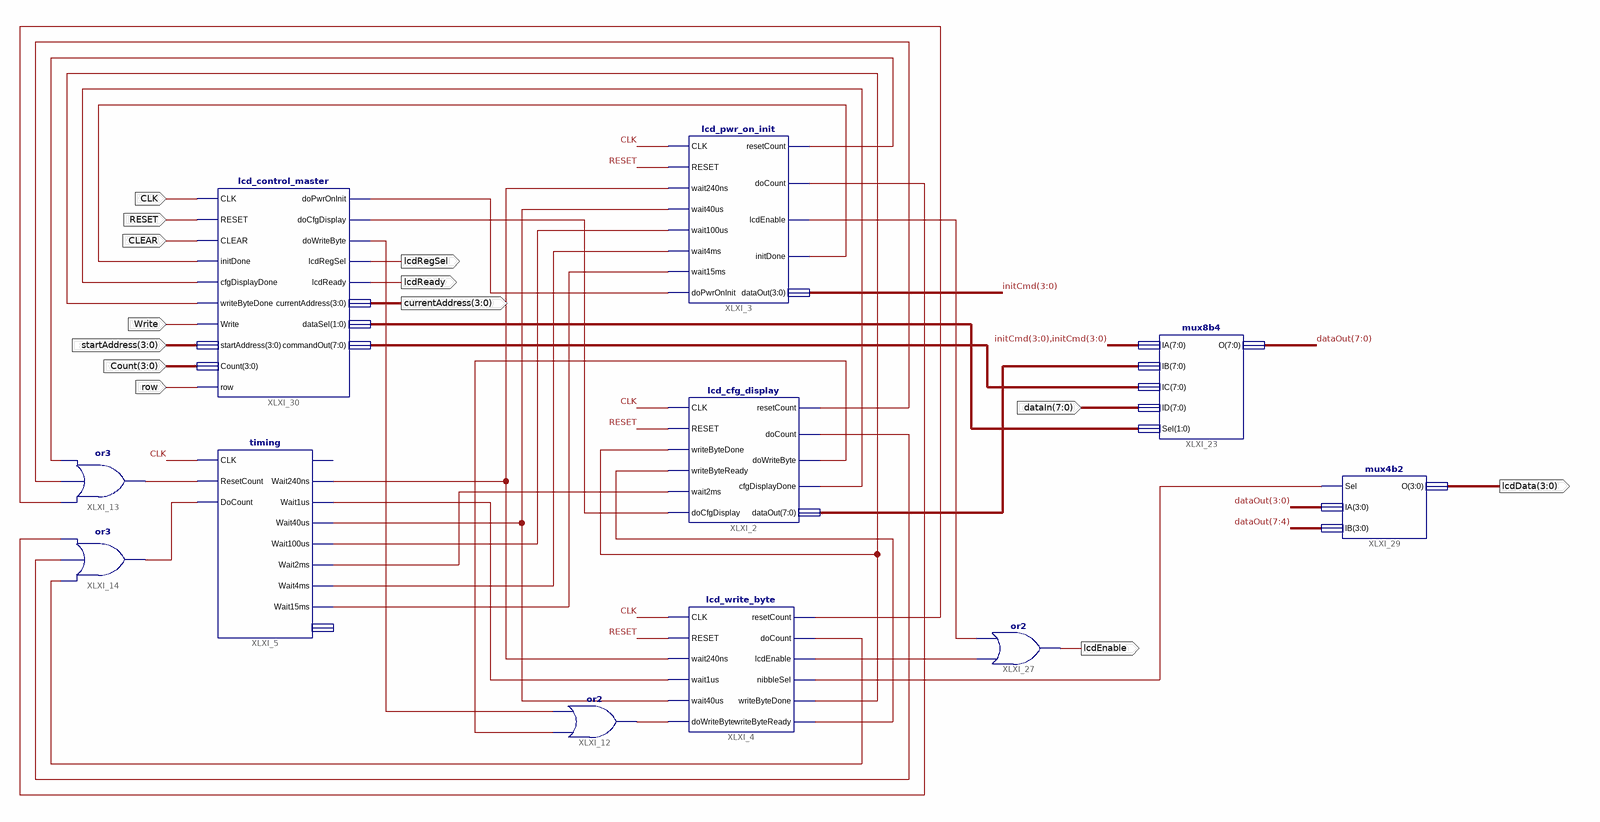
[diagram p0: schematic sheet 1]
// Xilinx ISE schematic lcd_control.sch (spartan3e) as structural Verilog: 11 symbols, 13 ports
module lcd_control (
  input  CLK,
  input  RESET,
  input  CLEAR,
  input  Write,
  input  [3:0] startAddress,
  input  [3:0] Count,
  input  [7:0] dataIn,
  input  row,
  output lcdEnable,
  output lcdRegSel,
  output lcdReady,
  output [3:0] currentAddress,
  output [3:0] lcdData
);

  wire doCfgDisplay, doPwrOnInit, doWriteByte, XLXN_24, XLXN_26, XLXN_27, XLXN_28, XLXN_29, XLXN_30, XLXN_32,
       XLXN_36, XLXN_38, XLXN_39, XLXN_40, XLXN_41, XLXN_42, XLXN_43, XLXN_44, XLXN_45, XLXN_46, XLXN_47,
       XLXN_48, XLXN_49, XLXN_95, XLXN_120, XLXN_121, XLXN_133;
  wire [1:0] dataSel;
  wire [3:0] initCmd;
  wire [7:0] dataOut, XLXN_102, XLXN_137;

  timing XLXI_5 (
    .CLK(CLK), .DoCount(XLXN_42), .ResetCount(XLXN_41), .Wait240ns(XLXN_24), .Wait1us(XLXN_32),
    .Wait40us(XLXN_26), .Wait100us(XLXN_27), .Wait2ms(XLXN_30), .Wait15ms(XLXN_29), .Wait4ms(XLXN_28));  // open: Wait40ns, CNT
  lcd_pwr_on_init XLXI_3 (
    .CLK(CLK), .RESET(RESET), .wait240ns(XLXN_24), .wait40us(XLXN_26), .wait100us(XLXN_27),
    .wait4ms(XLXN_28), .wait15ms(XLXN_29), .doPwrOnInit(doPwrOnInit), .dataOut(initCmd),
    .resetCount(XLXN_43), .doCount(XLXN_48), .lcdEnable(XLXN_120), .initDone(XLXN_49));
  lcd_cfg_display XLXI_2 (
    .CLK(CLK), .RESET(RESET), .writeByteDone(XLXN_39), .writeByteReady(XLXN_40), .wait2ms(XLXN_30),
    .doCfgDisplay(doCfgDisplay), .resetCount(XLXN_44), .doCount(XLXN_47), .doWriteByte(XLXN_38),
    .cfgDisplayDone(XLXN_95), .dataOut(XLXN_102));
  lcd_write_byte XLXI_4 (
    .CLK(CLK), .RESET(RESET), .wait240ns(XLXN_24), .wait1us(XLXN_32), .wait40us(XLXN_26),
    .doWriteByte(XLXN_36), .resetCount(XLXN_45), .doCount(XLXN_46), .lcdEnable(XLXN_121),
    .nibbleSel(XLXN_133), .writeByteDone(XLXN_39), .writeByteReady(XLXN_40));
  or XLXI_12 (XLXN_36, XLXN_38, doWriteByte);
  or XLXI_14 (XLXN_42, XLXN_46, XLXN_47, XLXN_48);
  or XLXI_13 (XLXN_41, XLXN_45, XLXN_44, XLXN_43);
  mux8b4 XLXI_23 (.IA({initCmd, initCmd}), .IB(XLXN_102), .IC(XLXN_137), .ID(dataIn), .Sel(dataSel), .O(dataOut));
  or XLXI_27 (lcdEnable, XLXN_121, XLXN_120);
  mux4b2 XLXI_29 (.Sel(XLXN_133), .IA(dataOut[3:0]), .IB(dataOut[7:4]), .O(lcdData));
  lcd_control_master XLXI_30 (
    .CLK(CLK), .RESET(RESET), .CLEAR(CLEAR), .initDone(XLXN_49), .cfgDisplayDone(XLXN_95),
    .writeByteDone(XLXN_39), .startAddress(startAddress), .Count(Count), .doPwrOnInit(doPwrOnInit),
    .doCfgDisplay(doCfgDisplay), .doWriteByte(doWriteByte), .lcdRegSel(lcdRegSel), .lcdReady(lcdReady),
    .currentAddress(currentAddress), .dataSel(dataSel), .commandOut(XLXN_137), .row(row), .Write(Write));
endmodule
